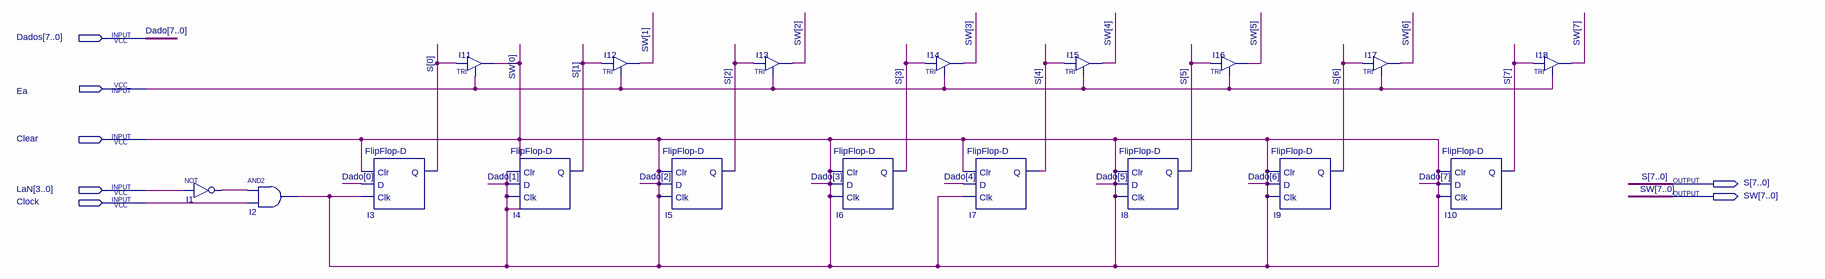
[diagram p0: schematic sheet]
// Quartus schematic Acumulador.bdf as structural Verilog: 18 symbols, 7 pins
module Acumulador (
  input  [7:0] Dados,
  input  Ea,
  input  Clear,
  input  [3:0] LaN,
  input  Clock,
  output [7:0] S,
  output [7:0] SW
);

  wire I1_out, undriven;

  not I1 (I1_out, undriven);
  and I2 (Clear, I1_out, Clock);
  \FlipFlop-D  I3 (.Clr(Clear), .D(Dados[0]), .Clk(Clear), .Q(S[0]));
  TRI I11 (.IN(S[0]), .OE(Ea), .OUT(Clear));
  \FlipFlop-D  I4 (.Clr(Clear), .D(Clear), .Clk(Clear), .Q(S[1]));
  TRI I12 (.IN(S[1]), .OE(Ea), .OUT(SW[1]));
  \FlipFlop-D  I5 (.Clr(Clear), .D(Clear), .Clk(Clear), .Q(S[2]));
  TRI I13 (.IN(S[2]), .OE(Ea), .OUT(SW[2]));
  \FlipFlop-D  I6 (.Clr(Clear), .D(Clear), .Clk(Clear), .Q(S[3]));
  TRI I14 (.IN(S[3]), .OE(Ea), .OUT(SW[3]));
  \FlipFlop-D  I7 (.Clr(Clear), .D(Dados[4]), .Clk(Clear), .Q(S[4]));
  TRI I15 (.IN(S[4]), .OE(Ea), .OUT(SW[4]));
  \FlipFlop-D  I8 (.Clr(Clear), .D(Clear), .Clk(Clear), .Q(S[5]));
  TRI I16 (.IN(S[5]), .OE(Ea), .OUT(SW[5]));
  \FlipFlop-D  I9 (.Clr(Clear), .D(Clear), .Clk(Clear), .Q(S[6]));
  TRI I17 (.IN(S[6]), .OE(Ea), .OUT(SW[6]));
  \FlipFlop-D  I10 (.Clr(Clear), .D(Clear), .Clk(Clear), .Q(S[7]));
  TRI I18 (.IN(S[7]), .OE(Ea), .OUT(SW[7]));

  assign {Dados[7:5], Dados[3:1]} = {6{Clear}};
  assign SW[0] = Clear;

  // Other names for the same wires on the sheet: Dado[7:0] = {{3{Clear}}, Dados[4], {3{Clear}}, Dados[0]}
endmodule
